# EAGLE schematic clock (EAGLE 6.4)
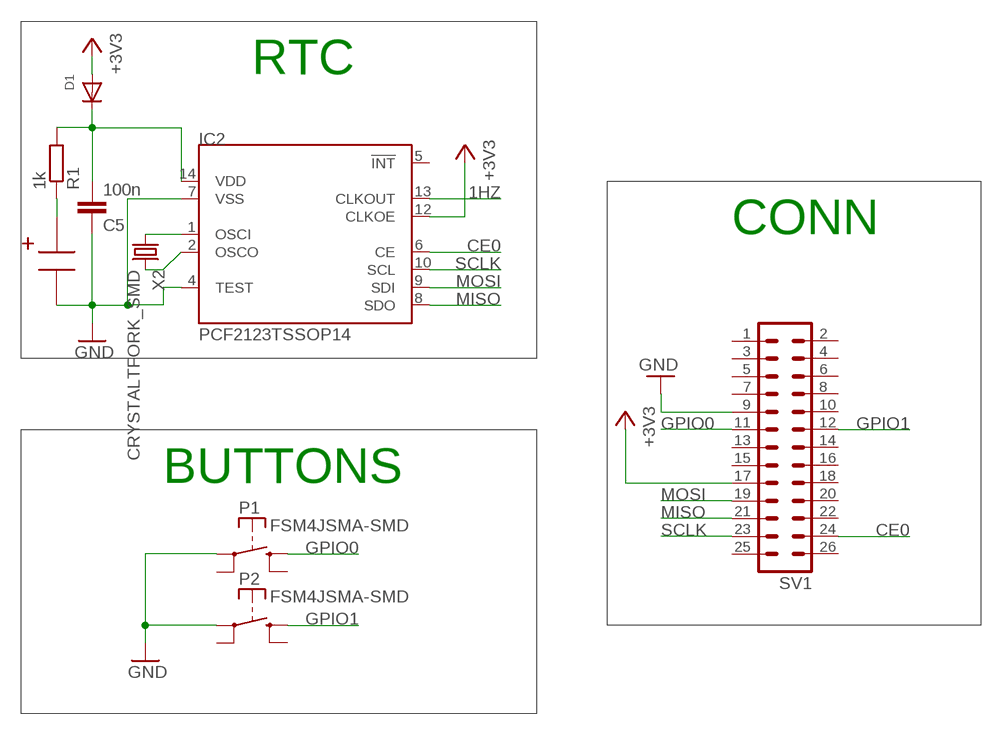
[diagram p0: schematic, sheet 1]

## Parts
C5  100n  C-EUC0603K  [C0603K]
D1  DIODESOD-523  [SOD-523]
IC2  PCF2123TSSOP14  [TSSOP14]
P1  FSM4JSMA-SMD  [FSM4JSMA-SMD]
P2  FSM4JSMA-SMD  [FSM4JSMA-SMD]
R1  1k  R-EU_R0603  [R0603]
SV1  MA13-2  [MA13-2]
U$1  DCK-3R3E224U-E  [SUPCAP-E]
X2  CRYSTALTFORK_SMD  [TFORK_SMD]

## Nets
1HZ: IC2.13(CLKOUT)
+3V3: D1.A IC2.12(CLKOE) SV1.17
CE0: IC2.6(CE) SV1.24
GND: C5.1 IC2.4(TEST) IC2.7(VSS) P1.P$1(P) P2.P$1(P) SV1.9 U$1.-
GPIO0: P1.P$3(S) SV1.11
GPIO1: P2.P$3(S) SV1.12
MISO: IC2.8(SDO) SV1.21
MOSI: IC2.9(SDI) SV1.19
N$1: R1.1 U$1.+
N$3: IC2.2(OSCO) X2.3
N$4: IC2.1(OSCI) X2.2
SCLK: IC2.10(SCL) SV1.23
VRTC: C5.2 D1.K(C) IC2.14(VDD) R1.2
Unconnected: IC2.5(!INT) P1.P$2(P) P1.P$4(S) P2.P$2(P) P2.P$4(S) SV1.1 SV1.2 SV1.3 SV1.4 SV1.5 SV1.6 SV1.7 SV1.8 SV1.10 SV1.13 SV1.14 SV1.15 SV1.16 SV1.18 SV1.20 SV1.22 SV1.25 SV1.26

## Notes on the sheet
- RTC
- CONN
- BUTTONS

## Library data of the parts
C5 = rcl:C-EU: CAPACITOR, European symbol
D1 = adafruit:DIODE: Diode SMADIODE - SMA Surface Mount Package 20V 1A Schottky Diode Digikey: 641-1014-6-ND DO-1N4148 - Through Hole Small Current Diode SOD-123 20V 1 A (.5mV Vf) Schottky Diode - Digikey: MBRX120TPMSCT-ND SOD-323 10V 570mA (.38mV Vf, 3ns) Schottky Diode - Digikey: ZLLS410CT-ND SOD-523 30V 30mA Schottky Diode (RB751S-40TE61) - Digikey: RB751S-40TE61CT-ND SOT23-R/W - SOT23 Package (R = Solder Paste/Reflow Ovens, W = Hand-Soldering) BAT54Film 40V 300mA - Digikey: 497-7162-1-ND
IC2 = jocki:PCF2123: edit this description Auto generated by make-symbol-device-package-bsdl.ulp Rev. 43 Source:
P1 P2 = switch-misc:FSM4JSMA-SMD: TYCO SWITCH
R1 = rcl:R-EU_: RESISTOR, European symbol
SV1 = con-lstb:MA13-2: PIN HEADER; OC_FARNELL: unknown; OC_NEWARK: unknown
U$1 = jocki:DCK-3R3E224U-E
X2 = jocki:CRYSTAL